# Altium schematic sheet ampInputBreakOutV1.SchDoc
size A4; SheetNumber: 2; SheetTotal: 3
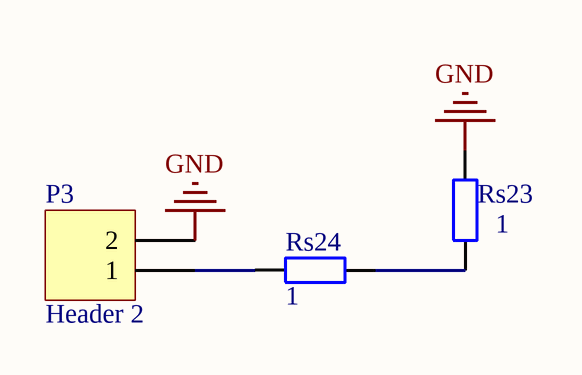
[diagram p0: ampInputBreakOutV1.SchDoc]

## Parts
P3  Header 2  [HDR1X2]
Rs23  1  [AXIAL-0.4 PCBK]
Rs24  1  [AXIAL-0.4 PCBK]

## Nets
GND: P3.2 Rs23.2
NetP3_1: P3.1 Rs24.1
NetRs23_1: Rs23.1 Rs24.2

## Library data of the parts
P3 = Header 2: Header, 2-Pin; LatestRevisionDate: 17-Jul-2002; LatestRevisionNote: Re-released for DXP Platform.; Publisher: Altium Limited
Rs23 Rs24 = Res PCBK: Resistor; Published: 8-Jun-2000; LatestRevisionDate: 17-Jul-2002; LatestRevisionNote: Re-released for DXP Platform.; PackageReference: AXIAL-0.4; Publisher: Altium Limited; Value: 1